# EAGLE schematic gun_cool (EAGLE 9.6.1)
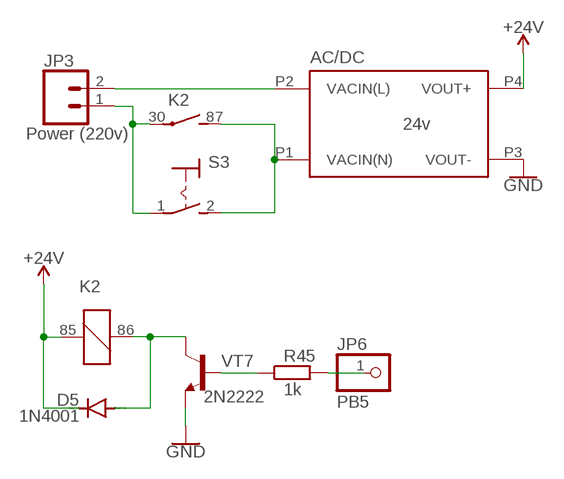
[diagram p0: schematic, sheet 1]

## Parts
AC/DC  24v  RAC02-24SC  [LOW_PROFILE_POWER_MODULE]
D5  1N4001  1N4004  [DO41-10]
JP3  Power (220v)  CONN_02  [1X02]
JP6  PB5  PINHD-1X1  [1X01]
K2  CB1A-T-P-24V  [CB1]
R45  1k  R-EU_M1206  [M1206]
S3  MS243  [MS243]
VT7  2N2222  [TO18]

## Nets
GND: AC/DC.P3(VOUT-) VT7.1(E)
N$1: AC/DC.P2(VACIN(L)) JP3.2
N$2: JP3.1 K2.30(2:P) S3.1(P)
N$3: AC/DC.P1(VACIN(N)) K2.87(2:S) S3.2(S)
N$7: JP6.1 R45.2
N$8: R45.1 VT7.2(B)
N$9: D5.A K2.86 VT7.3(C)
VCC: AC/DC.P4(VOUT+) D5.C K2.85 ; supply symbol labelled +24V

## Library data of the parts
AC/DC = recom-powerline-acdc-converters:RAC*SC: RECOM POWERLINE AC/DC-Converter (RAC01-SC and RAC02-SC series) The RAC01-SC and RAC02-SC series are ultra-compact universal input AC/DC power modules for PCB mounting. They feature high efficiency, low standby power, high operating temperature, soft start and short-circuit protection as well as a built-in EMC Class B filter. Output voltages range from 3.3VDC to 24VDC. Datasheet <http://www.recom-power.com/pdf/Powerline-AC-DC/RAC01_02-SC.pdf>; INPUT_RANGE: 80 - 277 (VAC); MAX_CAPACITIVE_LOAD: 47uF; OUTPUT_CURRENT: 83mA; OUTPUT_VOLTAGE: 24v
D5 = diode:1N4004: DIODE general purpose rectifier, 1 A
JP3 = SparkFun-Connectors:CONN_02: Multi connection point. Often used as Generic Header-pin footprint for 0.1 inch spaced/style header connections On any of the 0.1 inch spaced packages, you can populate with these: Break Away Headers - Straight <https://www.sparkfun.com/products/116> (PRT-00116) Break Away Male Headers - Right Angle <https://www.sparkfun.com/products/553> (PRT-00553) Female Headers <https://www.sparkfun.com/products/115> (PRT-00115) Break Away Headers - Machine Pin <https://www.sparkfun.com/products/117> (PRT-00117) Break Away Female Headers - Swiss Machine Pin <https://www.sparkfun.com/products/743> (PRT-00743) For SCREWTERMINALS and SPRING TERMINALS visit here: Screw Terimnals on SparkFun.com <https://www.sparkfun.com/search/results?term=Screw+Terminals> (5mm/3.5mm/2.54mm spacing) This device is also useful as a general connection point to wire up your design to another part of your project. Our various solder wires solder well into these plated through hole pads. Hook-Up Wire - Assortment (Stranded, 22 AWG) <https://www.sparkfun.com/products/11375> (PRT-11375) Hook-Up Wire - Assortment (Solid Core, 22 AWG) <https://www.sparkfun.com/products/11367> (PRT-11367) View the entire wire category on our website here <https://www.sparkfun.com/categories/141> Special notes: Molex polarized connector foot print use with: PRT-08233 with associated crimp pins and housings. 2.54_SCREWTERM for use with PRT-10571. 3.5mm Screw Terminal footprints for PRT-08084 5mm Screw Terminal footprints for use with PRT-08432
JP6 = pinhead:PINHD-1X1: PIN HEADER
K2 = relay:CB*: HIGH POWER AUTOMOTIVE RELAY Form A NAiS Source: http://www.mew-europe.com/.. en_ds_61202_0000.pdf; OC_FARNELL: unknown; OC_NEWARK: unknown
R45 = rcl:R-EU_: RESISTOR, European symbol; SPICEPREFIX: R
S3 = switch:MS243: TOGGLE SWITCH
VT7 = transistor:2N2222: NPN TRANSISTOR